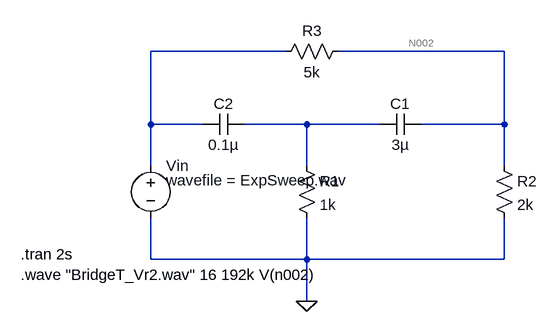
[diagram p0: schematic BridgeT.asc]
BridgeT.asc, the LTspice schematic file:
Version 4
SHEET 1 880 680
WIRE 256 80 48 80
WIRE 592 80 336 80
WIRE 48 192 48 80
WIRE 128 192 48 192
WIRE 288 192 192 192
WIRE 400 192 288 192
WIRE 592 192 592 80
WIRE 592 192 464 192
WIRE 48 256 48 192
WIRE 288 256 288 192
WIRE 592 256 592 192
WIRE 48 400 48 336
WIRE 288 400 288 336
WIRE 288 400 48 400
WIRE 592 400 592 336
WIRE 592 400 288 400
WIRE 288 464 288 400
FLAG 288 464 0
SYMBOL cap 400 208 R270
WINDOW 0 32 32 VTop 2
WINDOW 3 0 32 VBottom 2
SYMATTR InstName C1
SYMATTR Value 3µ
SYMBOL cap 128 208 R270
WINDOW 0 32 32 VTop 2
WINDOW 3 0 32 VBottom 2
SYMATTR InstName C2
SYMATTR Value 0.1µ
SYMBOL res 272 240 R0
SYMATTR InstName R1
SYMATTR Value 1k
SYMBOL res 576 240 R0
SYMATTR InstName R2
SYMATTR Value 2k
SYMBOL res 240 96 R270
WINDOW 0 32 56 VTop 2
WINDOW 3 0 56 VBottom 2
SYMATTR InstName R3
SYMATTR Value 5k
SYMBOL voltage 48 240 R0
WINDOW 3 24 38 Left 2
SYMATTR Value wavefile = ExpSweep.wav
SYMATTR InstName Vin
TEXT -152 392 Left 2 !.tran 2s\n.wave "BridgeT_Vr2.wav" 16 192k V(n002)

The netlist it stands for:
* BridgeT.asc
C1 N003 N002 3µ
C2 N001 N003 0.1µ
R1 N003 0 1k
R2 N002 0 2k
R3 N001 N002 5k
Vin N001 0 wavefile = ExpSweep.wav
.tran 2s
.wave "BridgeT_Vr2.wav" 16 192k V(n002)
.backanno
.end